# EAGLE schematic ControlParqueadero (EAGLE 5.07)

## Sheet 1 of 2
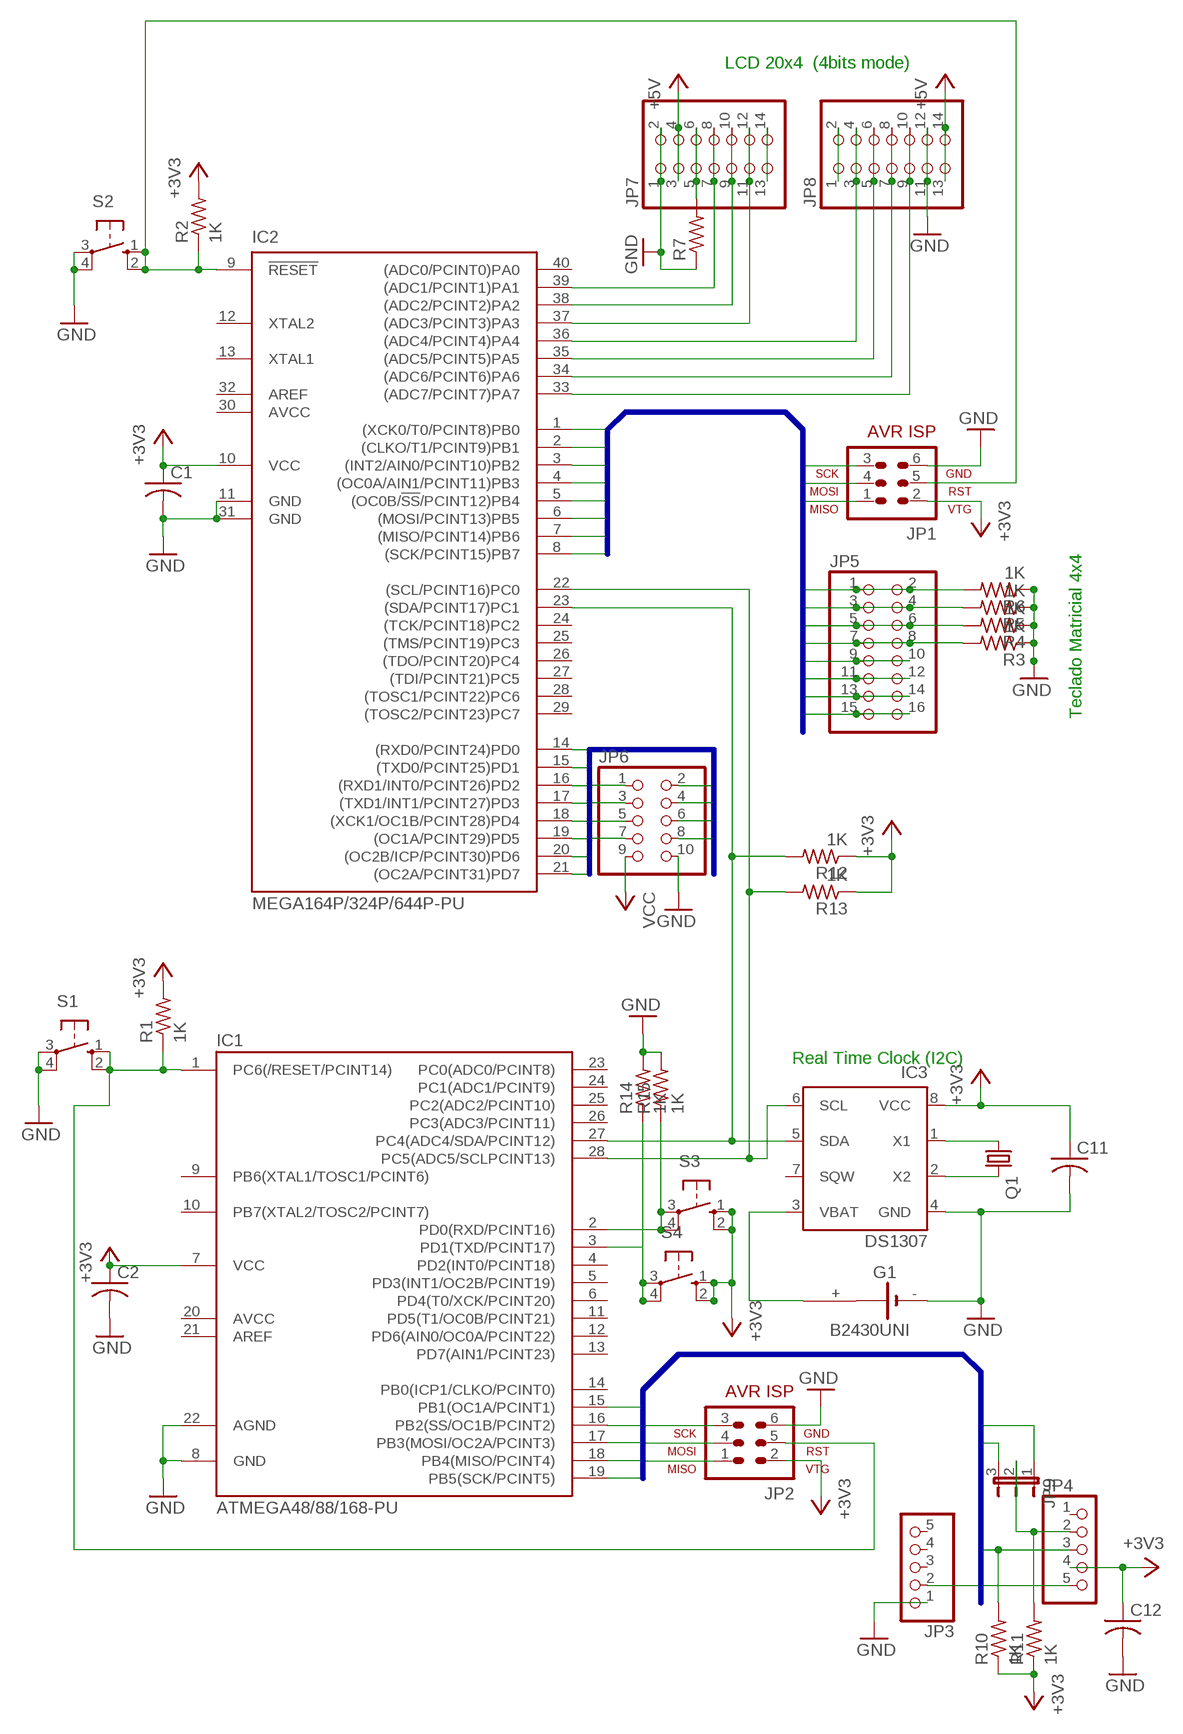
[diagram p0: schematic, sheet 1]

### Parts
C1  C-US025-025X050  [C025-025X050]
C2  C-US025-025X050  [C025-025X050]
C11  C-US025-025X050  [C025-025X050]
C12  C-US025-025X050  [C025-025X050]
G1  B2430UNI  [B2430UNI]
IC1  ATMEGA48/88/168-PU  [DIL28-3]
IC2  MEGA164P/324P/644P-PU  [DIL40]
IC3  DS1307  [DIL08]
JP1  AVR-ISP-6  [AVR-ISP-6]
JP2  AVR-ISP-6  [AVR-ISP-6]
JP3  PINHD-1X5  [1X05]
JP4  PINHD-1X5  [1X05]
JP5  PINHD-2X8  [2X08]
JP6  PINHD-2X5  [2X05]
JP7  PINHD-2X7  [2X07]
JP8  PINHD-2X7  [2X07]
JP9  JP2E  [JP2]
Q1  CRYSTALTC26V  [TC26V]
R1  1K  R-US_0204/7  [0204/7]
R2  1K  R-US_0204/7  [0204/7]
R3  1K  R-US_0204/7  [0204/7]
R4  1K  R-US_0204/7  [0204/7]
R5  1K  R-US_0204/7  [0204/7]
R6  1K  R-US_0204/7  [0204/7]
R7  R-US_0204/7  [0204/7]
R10  1K  R-US_0204/7  [0204/7]
R11  1K  R-US_0204/7  [0204/7]
R12  1K  R-US_0204/7  [0204/7]
R13  1K  R-US_0204/7  [0204/7]
R14  1K  R-US_0204/7  [0204/7]
R15  1K  R-US_0204/7  [0204/7]
S1  10-XX  [B3F-10XX]
S2  10-XX  [B3F-10XX]
S3  10-XX  [B3F-10XX]
S4  10-XX  [B3F-10XX]

### Nets
+3V3: C1.1 C2.1 C11.1 C12.1 IC1.7(VCC) IC2.10(VCC) IC3.8(VCC) JP1.2 JP2.2 JP4.4 R1.2 R2.2 R10.1 R11.1 R12.1 R13.1 S3.1(S) S3.2(S1) S4.1(S) S4.2(S1) ; also sheet 2
+5V: JP7.3 JP7.4 JP8.13 JP8.14 ; also sheet 2
GND: C1.2 C2.2 C11.2 C12.2 G1.- IC1.8(GND) IC1.22(AGND) IC2.11(GND) IC2.31(GND) IC3.4(GND) JP1.6 JP2.6 JP3.1 JP6.10 JP7.1 JP7.2 JP8.11 JP8.12 R3.1 R4.1 R5.1 R6.1 R7.1 R14.2 R15.2 S1.3(P) S1.4(P1) S2.3(P) S2.4(P1) ; also sheet 2
N$1: IC1.1(PC6(/RESET/PCINT14)) JP2.5 R1.1 S1.1(S) S1.2(S1)
N$2: IC1.2(PD0(RXD/PCINT16)) R15.1 S3.3(P) S3.4(P1)
N$3: IC2.9(!RESET) JP1.5 R2.1 S2.1(S) S2.2(S1)
N$4: IC1.3(PD1(TXD/PCINT17)) R14.1 S4.3(P) S4.4(P1)
N$5: JP4.2 JP9.2 R11.2
N$9: IC1.27(PC4(ADC4/SDA/PCINT12)) IC2.23((SDA/PCINT17)PC1) IC3.5(SDA) R12.2
N$11: IC1.28(PC5(ADC5/SCLPCINT13)) IC2.22((SCL/PCINT16)PC0) IC3.6(SCL) R13.2
N$19: IC3.2(X2) Q1.2
N$22: G1.+ IC3.3(VBAT)
N$27: IC2.33((ADC7/PCINT7)PA7) JP8.9 JP8.10
N$28: IC2.34((ADC6/PCINT6)PA6) JP8.7 JP8.8
N$29: IC2.35((ADC5/PCINT5)PA5) JP8.5 JP8.6
N$30: IC2.36((ADC4/PCINT4)PA4) JP8.3 JP8.4
N$32: IC3.1(X1) Q1.1
N$37: JP7.5 JP7.6 R7.2
N$38: IC2.39((ADC1/PCINT1)PA1) JP7.7 JP7.8
N$39: IC2.38((ADC2/PCINT2)PA2) JP7.9 JP7.10
N$40: IC2.37((ADC3/PCINT3)PA3) JP7.11 JP7.12
N$41: JP7.13 JP7.14
N$42: JP8.1 JP8.2
PORTB1: IC1.15(PB1(OC1A/PCINT1)) JP9.1
PORTB2: IC1.16(PB2(SS/OC1B/PCINT2)) JP9.3
PORTB3: IC1.17(PB3(MOSI/OC2A/PCINT3)) JP2.4 JP4.3 R10.2
PORTB4: IC1.18(PB4(MISO/PCINT4)) JP2.1 JP3.2
PORTB5: IC1.19(PB5(SCK/PCINT5)) JP2.3 JP4.5
PORTB_A0: IC2.1((XCK0/T0/PCINT8)PB0) JP5.1 JP5.2 R6.2
PORTB_A1: IC2.2((CLKO/T1/PCINT9)PB1) JP5.3 JP5.4 R5.2
PORTB_A2: IC2.3((INT2/AIN0/PCINT10)PB2) JP5.5 JP5.6 R4.2
PORTB_A3: IC2.4((OC0A/AIN1/PCINT11)PB3) JP5.7 JP5.8 R3.2
PORTB_A4: IC2.5((OC0B/!SS!/PCINT12)PB4) JP5.9 JP5.10
PORTB_A5: IC2.6((MOSI/PCINT13)PB5) JP1.4 JP5.11 JP5.12
PORTB_A6: IC2.7((MISO/PCINT14)PB6) JP1.1 JP5.13 JP5.14
PORTB_A7: IC2.8((SCK/PCINT15)PB7) JP1.3 JP5.15 JP5.16
PORTC0: IC2.14((RXD0/PCINT24)PD0) JP6.1
PORTC1: IC2.15((TXD0/PCINT25)PD1) JP6.2
PORTC2: IC2.16((RXD1/INT0/PCINT26)PD2) JP6.3
PORTC3: IC2.17((TXD1/INT1/PCINT27)PD3) JP6.4
PORTC4: IC2.18((XCK1/OC1B/PCINT28)PD4) JP6.5
PORTC5: IC2.19((OC1A/PCINT29)PD5) JP6.6
PORTC6: IC2.20((OC2B/ICP/PCINT30)PD6) JP6.7
PORTC7: IC2.21((OC2A/PCINT31)PD7) JP6.8
VCC: JP6.9 ; also sheet 2
Unconnected: G1.+@1(+) G1.+@2(+) G1.+@3(+) G1.+@4(+) G1.-@1(-) IC1.4(PD2(INT0/PCINT18)) IC1.5(PD3(INT1/OC2B/PCINT19)) IC1.6(PD4(T0/XCK/PCINT20)) IC1.9(PB6(XTAL1/TOSC1/PCINT6)) IC1.10(PB7(XTAL2/TOSC2/PCINT7)) IC1.11(PD5(T1/OC0B/PCINT21)) IC1.12(PD6(AIN0/OC0A/PCINT22)) IC1.13(PD7(AIN1/PCINT23)) IC1.14(PB0(ICP1/CLKO/PCINT0)) IC1.20(AVCC) IC1.21(AREF) IC1.23(PC0(ADC0/PCINT8)) IC1.24(PC1(ADC1/PCINT9)) IC1.25(PC2(ADC2/PCINT10)) IC1.26(PC3(ADC3/PCINT11)) IC2.12(XTAL2) IC2.13(XTAL1) IC2.24((TCK/PCINT18)PC2) IC2.25((TMS/PCINT19)PC3) IC2.26((TDO/PCINT20)PC4) IC2.27((TDI/PCINT21)PC5) IC2.28((TOSC1/PCINT22)PC6) IC2.29((TOSC2/PCINT23)PC7) IC2.40((ADC0/PCINT0)PA0) IC3.7(SQW) JP3.3 JP3.4 JP3.5 JP4.1

### Buses
PORTB[0..5]
PORTC[0..7]
PORTB_A[0..7]

### Notes on the sheet
- LCD 20x4  (4bits mode)
- Teclado Matricial 4x4
- Real Time Clock (I2C)

## Sheet 2 of 2
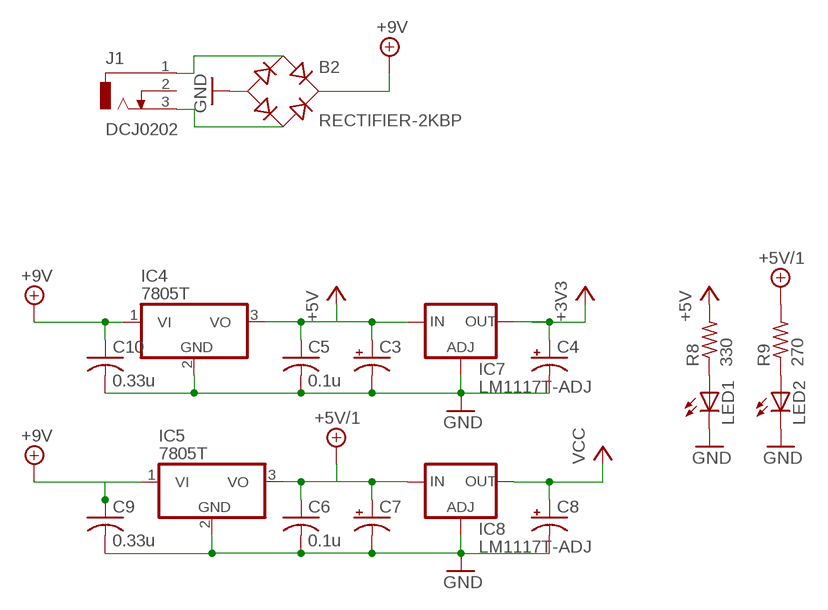
[diagram p1: schematic, sheet 2]

### Parts
B2  RECTIFIER-2KBP  [2KBP]
C3  CPOL-USE5-8.5  [E5-8,5]
C4  CPOL-USE5-8.5  [E5-8,5]
C5  0.1u  C-US025-025X050  [C025-025X050]
C6  0.1u  C-US025-025X050  [C025-025X050]
C7  CPOL-USE5-8.5  [E5-8,5]
C8  CPOL-USE5-8.5  [E5-8,5]
C9  0.33u  C-US050-035X075  [C050-035X075]
C10  0.33u  C-US050-035X075  [C050-035X075]
IC4  7805T  [TO220H]
IC5  7805T  [TO220H]
IC7  LM1117T-ADJ  [TO220]
IC8  LM1117T-ADJ  [TO220]
J1  DCJ0202  [DCJ0202]
LED1  LED5MM  [LED5MM]
LED2  LED5MM  [LED5MM]
R8  330  R-US_0204/7  [0204/7]
R9  270  R-US_0204/7  [0204/7]

### Nets
+3V3: C4.+ IC7.2(OUT) ; also sheet 1
+5V: C3.+ C5.1 IC4.3(VO) IC7.3(IN) R8.2 ; also sheet 1
+5V/1: C6.1 C7.+ IC5.3(VO) IC8.3(IN) R9.2
+9V: B2.+ C9.1 C10.1 IC4.1(VI) IC5.1(VI)
GND: B2.- C3.- C4.- C5.2 C6.2 C7.- C8.- C9.2 C10.2 IC4.2(GND) IC5.2(GND) IC7.1(ADJ) IC8.1(ADJ) LED1.K(C) LED2.K(C) ; also sheet 1
N$21: LED1.A R8.1
N$23: B2.AC1 J1.1
N$24: B2.AC2 J1.3
N$25: LED2.A R9.1
VCC: C8.+ IC8.2(OUT) ; also sheet 1
Unconnected: J1.2

## Power pins joined to a net without a drawn wire
AREF: IC2.32(AREF)
AVCC: IC2.30(AVCC)

## Library data of the parts
B2 = rectifier:RECTIFIER-: Rectifier
C1 C2 C5 C6 C9-C12 = rcl:C-US: CAPACITOR, American symbol
C3 C4 C7 C8 = rcl:CPOL-US: POLARIZED CAPACITOR, American symbol
G1 = battery:B2430UNI: LI BATTERY
IC1 = atmega8:ATMEGA48/88/168-PU
IC2 = avr-6:MEGA164P/324P/644P-PU
IC3 = ds1307_pcf8583:DS1307: I2C-Bus CLOCK/CALENDAR
IC4 IC5 = linear:78*: Positive VOLTAGE REGULATOR Source: http://cache.national.com/ds/LM/LM78L05.pdf http://www.fairchildsemi.com/ds/LM/LM7805.pdf
IC7 IC8 = lm1117:LM1117T-ADJ
J1 = con-jack:DCJ0202: DC POWER JACK Source: DCJ0202.pdf
JP1 JP2 = avr-6:AVR-ISP-6: AVR ISP-6 Serial Programming Header
JP3 JP4 = pinhead:PINHD-1X5: PIN HEADER
JP5 = pinhead:PINHD-2X8: PIN HEADER
JP6 = pinhead:PINHD-2X5: PIN HEADER
JP7 JP8 = pinhead:PINHD-2X7: PIN HEADER
JP9 = jumper:JP2E: JUMPER
LED1 LED2 = led:LED: LED OSRAM: - CHIPLED LG R971, LG N971, LY N971, LG Q971, LY Q971, LO R971, LY R971 LH N974, LH R974 LS Q976, LO Q976, LY Q976 LO Q996 - Hyper CHIPLED LW Q18S LB Q993, LB Q99A, LB R99A - SideLED LS A670, LO A670, LY A670, LG A670, LP A670 LB A673, LV A673, LT A673, LW A673 LH A674 LY A675 LS A676, LA A676, LO A676, LY A676, LW A676 LS A679, LY A679, LG A679 - Hyper Micro SIDELED® LS Y876, LA Y876, LO Y876, LY Y876 LT Y87S - SmartLED LW L88C, LW L88S LB L89C, LB L89S, LG L890 LS L89K, LO L89K, LY L89K LS L896, LA L896, LO L896, LY L896 - TOPLED LS T670, LO T670, LY T670, LG T670, LP T670 LSG T670, LSP T670, LSY T670, LOP T670, LYG T670 LG T671, LOG T671, LSG T671 LB T673, LV T673, LT T673, LW T673 LH T674 LS T676, LA T676, LO T676, LY T676, LB T676, LH T676, LSB T676, LW T676 LB T67C, LV T67C, LT T67C, LS T67K, LO T67K, LY T67K, LW E67C LS E67B, LA E67B, LO E67B, LY E67B, LB E67C, LV E67C, LT E67C LW T67C LS T679, LY T679, LG T679 LS T770, LO T770, LY T770, LG T770, LP T770 LB T773, LV T773, LT T773, LW T773 LH T774 LS E675, LA E675, LY E675, LS T675 LS T776, LA T776, LO T776, LY T776, LB T776 LHGB T686 LT T68C, LB T68C - Hyper Mini TOPLED® LB M676 - Mini TOPLED Santana® LG M470 LS M47K, LO M47K, LY M47K Source: http://www.osram.convergy.de LUXEON: - LUMILED® LXK2-PW12-R00, LXK2-PW12-S00, LXK2-PW14-U00, LXK2-PW14-V00 LXK2-PM12-R00, LXK2-PM12-S00, LXK2-PM14-U00 LXK2-PE12-Q00, LXK2-PE12-R00, LXK2-PE12-S00, LXK2-PE14-T00, LXK2-PE14-U00 LXK2-PB12-K00, LXK2-PB12-L00, LXK2-PB12-M00, LXK2-PB14-N00, LXK2-PB14-P00, LXK2-PB14-Q00 LXK2-PR12-L00, LXK2-PR12-M00, LXK2-PR14-Q00, LXK2-PR14-R00 LXK2-PD12-Q00, LXK2-PD12-R00, LXK2-PD12-S00 LXK2-PH12-R00, LXK2-PH12-S00 LXK2-PL12-P00, LXK2-PL12-Q00, LXK2-PL12-R00 Source: www.luxeon.com KINGBRIGHT: KA-3528ASYC Source: www.kingbright.com
Q1 = crystal:CRYSTAL: CRYSTAL
R1-R15 = rcl:R-US_: RESISTOR, American symbol
S1-S4 = switch-omron:10-XX: OMRON SWITCH